# Altium project HC32brd.PrjPCB
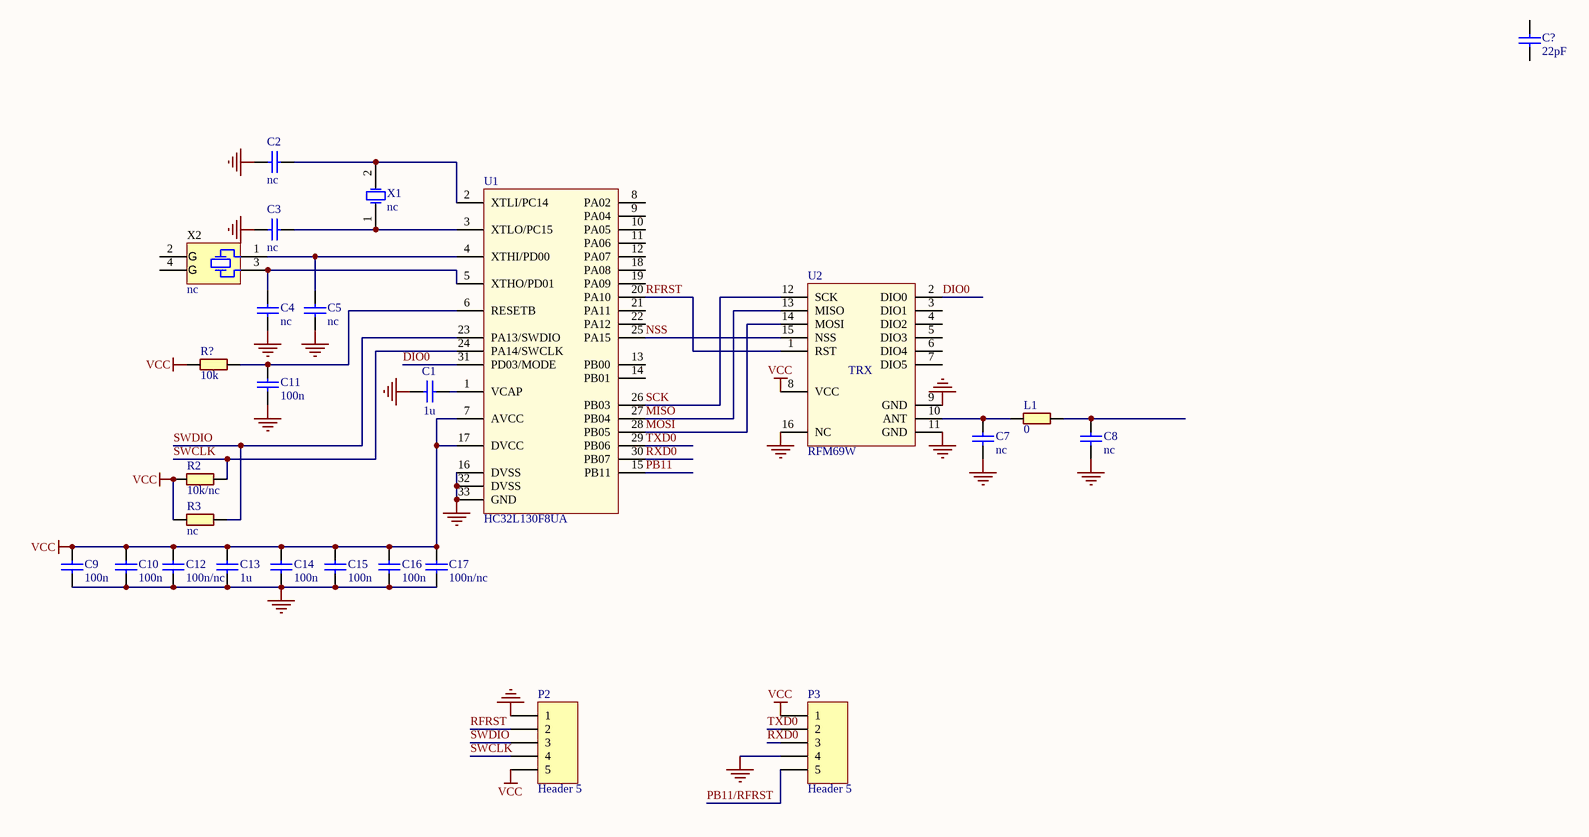
[diagram p0: HC32brd.SchDoc]
1 sheet, 27 parts. Net scope: global (net labels, ports and power ports of the same name join across sheets).

## Sheet HC32brd.SchDoc
size 420 x 297 mm; Scale: {Масш.}; Title1str: {Наименование}; PageSetup: Record=PageOptions|CenterHorizontal=False|CenterVertical=False|PrintScale=0.95|XCorrection=0.00|YCorrection=0.00|PrintKind=1|BorderSize=5000000|LeftOffset=0|BottomOffset=0|Orientation=1|PaperLength=1000|PaperWidth=1000|Scale=100|PaperSource=15|PrintQuality=600|MediaType=1|DitherType=10|PaperKind=A4|PrintScaleMode=1; Title2str: {Наименование}; ProcessInspection: {Т.контр.}; Mass: {Масса}; NormInspection: {Н.контр.}; EngineerName: {Инженер}; Letter1Column: {}; Letter2Column: {}; Letter3Column: {}; DocumentType: {Документ}; DocumentType1str: {Документ}; DocumentType2str: {Документ}

### Parts
C1  1u  [CAPC1608X08N]
C2  nc  [CAPC1608X08N]
C3  nc  [CAPC1608X08N]
C4  nc  [CAPC1608X08N]
C5  nc  [CAPC1608X08N]
C7  nc  [CAPC1608X08N]
C8  nc  [CAPC1608X08N]
C9  100n  [CAPC1608X08N]
C10  100n  [CAPC1608X08N]
C11  100n  [CAPC1608X08N]
C12  100n/nc  [CAPC1608X08N]
C13  1u  [CAPC1608X08N]
C14  100n  [CAPC1608X08N]
C15  100n  [CAPC1608X08N]
C16  100n  [CAPC1608X08N]
C17  100n/nc  [CAPC1608X08N]
C?  22pF  [CAPC1608X08N]
L1  0  [R-0603]
P2  Header 5  [HDR1X5]
P3  Header 5  [HDR1X5]
R2  10k/nc  [R-0603]
R3  nc  [R-0603]
R?  10k  [R-0603]
U1  HC32L130F8UA
U2  RFM69W  [LGA16_RFM69]
X1  nc  [R38]
X2  nc  [EPSON_TSX-3225]

### Nets
GND: C1.1 C2.2 C3.1 C4.2 C5.2 C7.1 C8.1 C9.1 C10.1 C11.2 C12.2 C13.1 C14.2 C15.2 C16.1 C17.1 P2.1 P3.4 U1.16(DVSS) U1.32(DVSS) U1.33(GND) U2.9(GND) U2.11(GND) U2.16(NC)
VCC: C9.2 C10.2 C12.1 C13.2 C14.1 C15.1 C16.2 C17.2 P2.5 P3.1 R2.1 R3.1 R?.1 U1.7(AVCC) U1.17(DVCC) U2.8(VCC)
DIO0: U1.31(PD03/MODE) U2.2(DIO0)
MISO: U1.27(PB04) U2.13(MISO)
MOSI: U1.28(PB05) U2.14(MOSI)
NSS: U1.25(PA15) U2.15(NSS)
PB11: U1.15(PB11)
PB11/RFRST: P3.5
RFRST: P2.2 U1.20(PA10) U2.1(RST)
RXD0: P3.3 U1.30(PB07)
SCK: U1.26(PB03) U2.12(SCK)
SWCLK: P2.4 R2.2 U1.24(PA14/SWCLK)
SWDIO: P2.3 R3.2 U1.23(PA13/SWDIO)
TXD0: P3.2 U1.29(PB06)
NetC1_2: C1.2 U1.1(VCAP)
NetC2_1: C2.1 U1.2(XTLI/PC14) X1.2(OSC2)
NetC3_2: C3.2 U1.3(XTLO/PC15) X1.1(OSC1)
NetC4_1: C4.1 U1.5(XTHO/PD01) X2.3
NetC5_1: C5.1 U1.4(XTHI/PD00) X2.1
NetC7_2: C7.2 L1.1 U2.10(ANT)
NetC8_2: C8.2 L1.2
NetC11_1: C11.1 R?.2 U1.6(RESETB)

Not connected (* = marked no-connect by the designer): C? 1 2; U1 8(PA02) 9(PA04) 10(PA05) 11(PA06) 12(PA07) 13(PB00) 14(PB01) 18(PA08) 19(PA09) 21(PA11) 22(PA12); U2 3(DIO1) 4(DIO2) 5(DIO3) 6(DIO4) 7(DIO5); X2 2(GND) 4(GND)

### Notes on the sheet
- Перв. примен.
- Справ. №
- Подп. и дата
- Инв. № дубл.
- Взам. инв. №
- Изм.
- Лист
- № докум.
- Подп.
- Дата
- Лит.
- Масса
- Масштаб
- Т.контр.
- Пров.
- Разраб.
- Листов
- Инв. № подл.
- Н.контр.
- Утв.
- Копировал
- Формат А3
- (in symbol RFM69HW_V13_2) TRX
- (in symbol TSX-3225 24.0000MF20G-AC3) G

### Library data of the parts
C1-C5 C7-C17 C? = CAPN: Вид: Конденсатор; Корпус: =Footprint
  C1 C13: Тип: 1u
  C2-C5 C7 C8: Тип: nc
  C9-C11 C14-C16: Тип: 100n
  C12 C17: Тип: 100n/nc
  C?: Тип: 22pF
L1 R2 R3 R? = RES: Вид: Резистор; Корпус: =Footprint
  L1: Тип: 0
  R2: Тип: 10k/nc
  R3: Тип: nc
  R?: Тип: 10k
P2 P3 = Header 5: Header, 5-Pin; LatestRevisionDate: 17-Jul-2002; LatestRevisionNote: Re-released for DXP Platform.; Publisher: Altium Limited
U2 = RFM69HW_V13_2: Вид: Модуль; Корпус: =Footprint; Тип: RFM69W
X1 = XTAL: Crystal Oscillator; Published: 8-Jun-2000; LatestRevisionDate: 17-Jul-2002; LatestRevisionNote: Re-released for DXP Platform.; PackageReference: R38; Publisher: Altium Limited; PackageDescription: Crystal, Thru-Hole; 2 Leads; Body 3.1 x 8.2 mm (Dia.xH)
X2 = TSX-3225 24.0000MF20G-AC3: Crystal, 24 MHz, 9 pF, SMD; Manufacturer: Epson; Вид: Кварц; PartNumber: TSX-3225 24.0000MF20G-AC3; CompType: Crystal; PackageReference: SMD, 4-Leads, Body 2.65x3.35mm, Height 0.6mm; MountType: SMT; Корпус: =Footprint; Тип: nc